# Altium schematic sheet Capacitors Package.SchDoc
size 101 x 38 mm
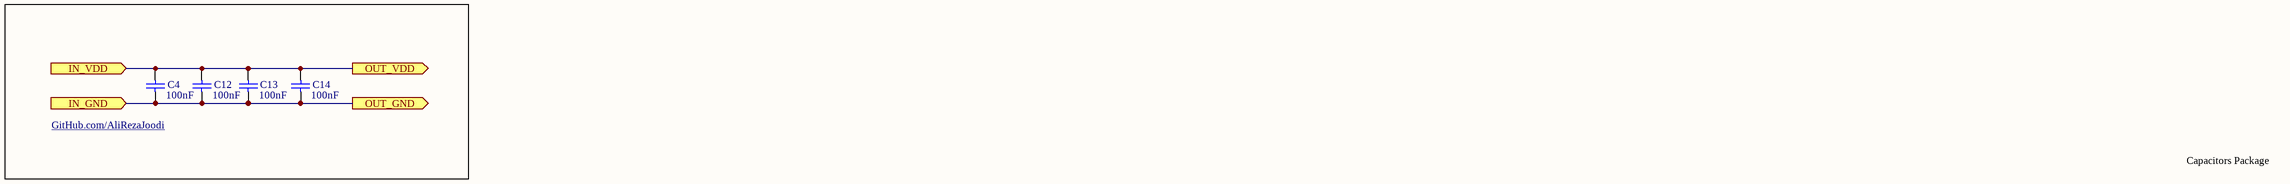
[diagram p0: Capacitors Package.SchDoc]

## Parts
C4  100nF  [CAPNTO2.54-3.05x1.78A]
C12  100nF  [CAPNTO2.54-3.05x1.78A]
C13  100nF  [CAPNTO2.54-3.05x1.78A]
C14  100nF  [CAPNTO2.54-3.05x1.78A]

## Ports
IN_GND (in), IN_VDD (in), OUT_GND (out), OUT_VDD (out)

## Nets
IN_GND: C4.1 C12.1 C13.1 C14.1 ; port IN_GND, port OUT_GND
IN_VDD: C4.2 C12.2 C13.2 C14.2 ; port IN_VDD, port OUT_VDD

## Notes on the sheet
- GitHub.com/AliRezaJoodi
- Capacitors Package

## Library data of the parts
C4 C12-C14 = Cap: Capacitor; Manufacturer: Generic Components; Class I: Passive; Published: 8-Jun-2000; Revision: July-2002: Re-released for DXP Platform.; Publisher: Altium Limited; Class II: Capacitor; Value: 100nF